# Altium project V_FB.PrjPcb
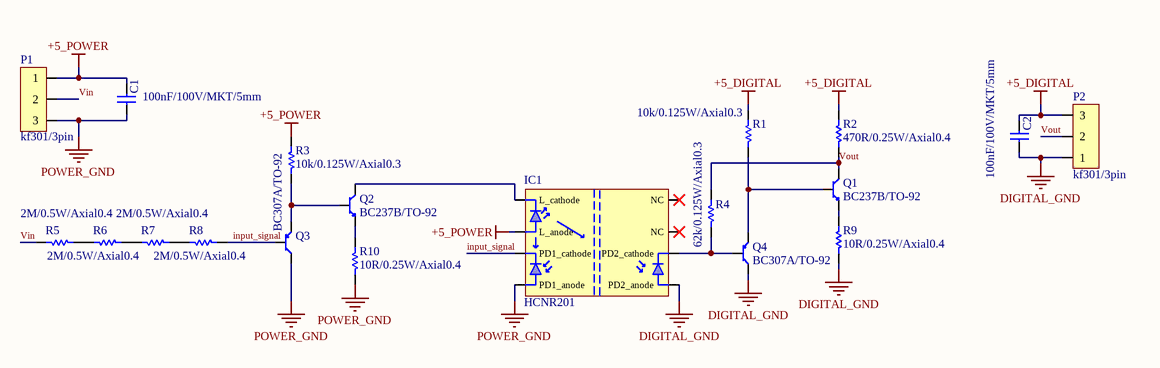
[diagram p0: V_FB.SchDoc]
1 sheet, 19 parts. Net scope: global (net labels, ports and power ports of the same name join across sheets).
Board file: V_FB.PcbDoc

## Sheet V_FB.SchDoc
size 297 x 209 mm; SheetNumber: 1; SheetTotal: 1

### Parts
C1  100nF/100V/MKT/5mm  [mkt 5mm]
C2  100nF/100V/MKT/5mm  [mkt 5mm]
IC1  HCNR201  [HCNR201_DIP8]
P1  kf301/3pin  [kf301/3pin]
P2  kf301/3pin  [kf301/3pin]
Q1  BC237B/TO-92  [TO-92]
Q2  BC237B/TO-92  [TO-92]
Q3  BC307A/TO-92  [TO-92]
Q4  BC307A/TO-92  [TO-92]
R1  10k/0.125W/Axial0.3  [Axial 0.3]
R2  470R/0.25W/Axial0.4  [Axial 0.4]
R3  10k/0.125W/Axial0.3  [Axial 0.3]
R4  62k/0.125W/Axial0.3  [Axial 0.3]
R5  2M/0.5W/Axial0.4  [Axial 0.4]
R6  2M/0.5W/Axial0.4  [Axial 0.4]
R7  2M/0.5W/Axial0.4  [Axial 0.4]
R8  2M/0.5W/Axial0.4  [Axial 0.4]
R9  10R/0.25W/Axial0.4  [Axial 0.4]
R10  10R/0.25W/Axial0.4  [Axial 0.4]

### Nets
+5_DIGITAL: C2.2(-) P2.3 R1.1 R2.1
+5_POWER: C1.2(-) IC1.2(L_anode) P1.1 R3.1
DIGITAL_GND: C2.1(+) IC1.5(PD2_anode) P2.1 Q4.1(C) R9.2
POWER_GND: C1.1(+) IC1.4(PD1_anode) P1.3 Q3.1(C) R10.2
input_signal: IC1.3(PD1_cathode) Q3.2(B) R8.2
Vin: P1.2 R5.1
Vout: P2.2 Q1.1(C) R2.2 R4.2
NetIC1_1: IC1.1(L_cathode) Q2.1(C)
NetIC1_6: IC1.6(PD2_cathode) Q4.2(B) R4.1
NetQ1_2: Q1.2(B) Q4.3(E) R1.2
NetQ1_3: Q1.3(E) R9.1
NetQ2_2: Q2.2(B) Q3.3(E) R3.2
NetQ2_3: Q2.3(E) R10.1
NetR5_2: R5.2 R6.1
NetR6_2: R6.2 R7.1
NetR7_2: R7.2 R8.1

Not connected (* = marked no-connect by the designer): IC1 7(NC)* 8(NC)*

### Library data of the parts
C1 C2 = Capacitor
IC1 = HCNR201: isolate linear optocoupler
P1 P2 = kf301/3pin: RELAY; LatestRevisionDate: 17-Jul-2002; LatestRevisionNote: Re-released for DXP Platform.; Publisher: Altium Limited
Q1 Q2 = BC237B: npn
Q3 Q4 = BC307A: pnp
R1-R10 = Res: Resistor; Published: 8-Jun-2000; LatestRevisionDate: 17-Jul-2002; LatestRevisionNote: Re-released for DXP Platform.; PackageReference: AXIAL-0.3; Publisher: Altium Limited; PackageDescription: Axial Device, Thru-Hole; 2 Leads; 0.3 in Pin Spacing
  R1 R3: Value: 10k/0.125W/Axial0.3
  R2: Value: 470R/0.25W/Axial0.4
  R4: Value: 62k/0.125W/Axial0.3
  R5-R8: Value: 2M/0.5W/Axial0.4
  R9 R10: Value: 10R/0.25W/Axial0.4